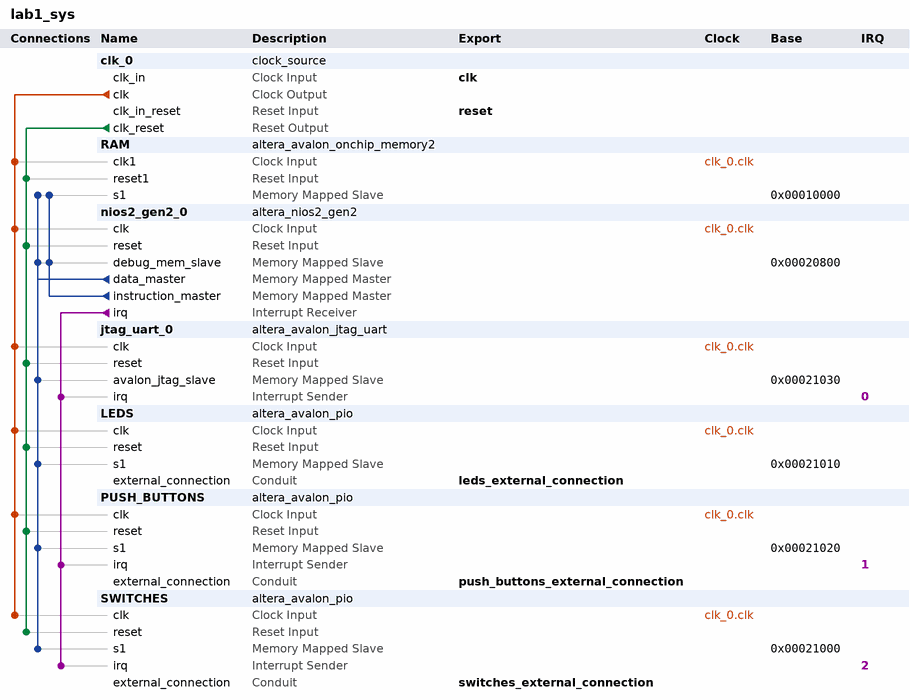
[diagram p0: system contents]
# Platform Designer (Qsys) system lab1_sys, MAX 10 10M50DAF484C6GES
# Parameters at their usual value, and those the tool derives, are not listed.
package require -exact qsys 18.1
create_system lab1_sys
set_project_property DEVICE_FAMILY {MAX 10}
set_project_property DEVICE 10M50DAF484C6GES

add_instance clk_0 clock_source 18.1
set_instance_parameter_value clk_0 clockFrequency 50000000

add_instance RAM altera_avalon_onchip_memory2 18.1
set_instance_parameter_value RAM dataWidth 32
set_instance_parameter_value RAM dualPort false
set_instance_parameter_value RAM initMemContent true
set_instance_parameter_value RAM initializationFileName F:/Ecole/GE5A/ESN11/lab1/software/app/mem_init/lab1_sys_RAM.hex
set_instance_parameter_value RAM memorySize 40960
set_instance_parameter_value RAM useNonDefaultInitFile true

add_instance nios2_gen2_0 altera_nios2_gen2 18.1
set_instance_parameter_value nios2_gen2_0 dcache_size 2048
set_instance_parameter_value nios2_gen2_0 exceptionSlave RAM.s1
set_instance_parameter_value nios2_gen2_0 icache_size 4096
set_instance_parameter_value nios2_gen2_0 impl Tiny
set_instance_parameter_value nios2_gen2_0 resetSlave RAM.s1

add_instance jtag_uart_0 altera_avalon_jtag_uart 18.1
set_instance_parameter_value jtag_uart_0 simInteractiveOptions NO_INTERACTIVE_WINDOWS

add_instance LEDS altera_avalon_pio 18.1
set_instance_parameter_value LEDS direction Output
set_instance_parameter_value LEDS width 10

add_instance PUSH_BUTTONS altera_avalon_pio 18.1
set_instance_parameter_value PUSH_BUTTONS bitClearingEdgeCapReg true
set_instance_parameter_value PUSH_BUTTONS captureEdge true
set_instance_parameter_value PUSH_BUTTONS direction Input
set_instance_parameter_value PUSH_BUTTONS edgeType FALLING
set_instance_parameter_value PUSH_BUTTONS generateIRQ true
set_instance_parameter_value PUSH_BUTTONS irqType EDGE
set_instance_parameter_value PUSH_BUTTONS width 1

add_instance SWITCHES altera_avalon_pio 18.1
set_instance_parameter_value SWITCHES bitClearingEdgeCapReg true
set_instance_parameter_value SWITCHES captureEdge true
set_instance_parameter_value SWITCHES direction Input
set_instance_parameter_value SWITCHES edgeType ANY
set_instance_parameter_value SWITCHES generateIRQ true
set_instance_parameter_value SWITCHES irqType EDGE
set_instance_parameter_value SWITCHES width 4

# connections
add_connection clk_0.clk jtag_uart_0.clk clock
add_connection clk_0.clk LEDS.clk clock
add_connection clk_0.clk nios2_gen2_0.clk clock
add_connection clk_0.clk PUSH_BUTTONS.clk clock
add_connection clk_0.clk RAM.clk1 clock
add_connection clk_0.clk SWITCHES.clk clock
add_connection clk_0.clk_reset jtag_uart_0.reset reset
add_connection clk_0.clk_reset LEDS.reset reset
add_connection clk_0.clk_reset nios2_gen2_0.reset reset
add_connection clk_0.clk_reset PUSH_BUTTONS.reset reset
add_connection clk_0.clk_reset RAM.reset1 reset
add_connection clk_0.clk_reset SWITCHES.reset reset
add_connection nios2_gen2_0.data_master jtag_uart_0.avalon_jtag_slave avalon
set_connection_parameter_value nios2_gen2_0.data_master/jtag_uart_0.avalon_jtag_slave baseAddress 0x00021030
add_connection nios2_gen2_0.data_master LEDS.s1 avalon
set_connection_parameter_value nios2_gen2_0.data_master/LEDS.s1 baseAddress 0x00021010
add_connection nios2_gen2_0.data_master nios2_gen2_0.debug_mem_slave avalon
set_connection_parameter_value nios2_gen2_0.data_master/nios2_gen2_0.debug_mem_slave baseAddress 0x00020800
add_connection nios2_gen2_0.data_master PUSH_BUTTONS.s1 avalon
set_connection_parameter_value nios2_gen2_0.data_master/PUSH_BUTTONS.s1 baseAddress 0x00021020
add_connection nios2_gen2_0.data_master RAM.s1 avalon
set_connection_parameter_value nios2_gen2_0.data_master/RAM.s1 baseAddress 0x00010000
add_connection nios2_gen2_0.data_master SWITCHES.s1 avalon
set_connection_parameter_value nios2_gen2_0.data_master/SWITCHES.s1 baseAddress 0x00021000
add_connection nios2_gen2_0.instruction_master nios2_gen2_0.debug_mem_slave avalon
set_connection_parameter_value nios2_gen2_0.instruction_master/nios2_gen2_0.debug_mem_slave baseAddress 0x00020800
add_connection nios2_gen2_0.instruction_master RAM.s1 avalon
set_connection_parameter_value nios2_gen2_0.instruction_master/RAM.s1 baseAddress 0x00010000
add_connection nios2_gen2_0.irq jtag_uart_0.irq interrupt
set_connection_parameter_value nios2_gen2_0.irq/jtag_uart_0.irq irqNumber 0
add_connection nios2_gen2_0.irq PUSH_BUTTONS.irq interrupt
set_connection_parameter_value nios2_gen2_0.irq/PUSH_BUTTONS.irq irqNumber 1
add_connection nios2_gen2_0.irq SWITCHES.irq interrupt
set_connection_parameter_value nios2_gen2_0.irq/SWITCHES.irq irqNumber 2

# exported interfaces
add_interface clk clock sink
set_interface_property clk EXPORT_OF clk_0.clk_in
add_interface leds_external_connection conduit end
set_interface_property leds_external_connection EXPORT_OF LEDS.external_connection
add_interface push_buttons_external_connection conduit end
set_interface_property push_buttons_external_connection EXPORT_OF PUSH_BUTTONS.external_connection
add_interface reset reset sink
set_interface_property reset EXPORT_OF clk_0.clk_in_reset
add_interface switches_external_connection conduit end
set_interface_property switches_external_connection EXPORT_OF SWITCHES.external_connection

set_interconnect_requirement {$system} qsys_mm.clockCrossingAdapter HANDSHAKE
set_interconnect_requirement {$system} qsys_mm.enableEccProtection FALSE
set_interconnect_requirement {$system} qsys_mm.insertDefaultSlave FALSE
set_interconnect_requirement {$system} qsys_mm.maxAdditionalLatency 1

save_system lab1_sys.qsys
